# Altium schematic sheet Power.SchDoc
size A3; SheetNumber: 3; SheetTotal: 7
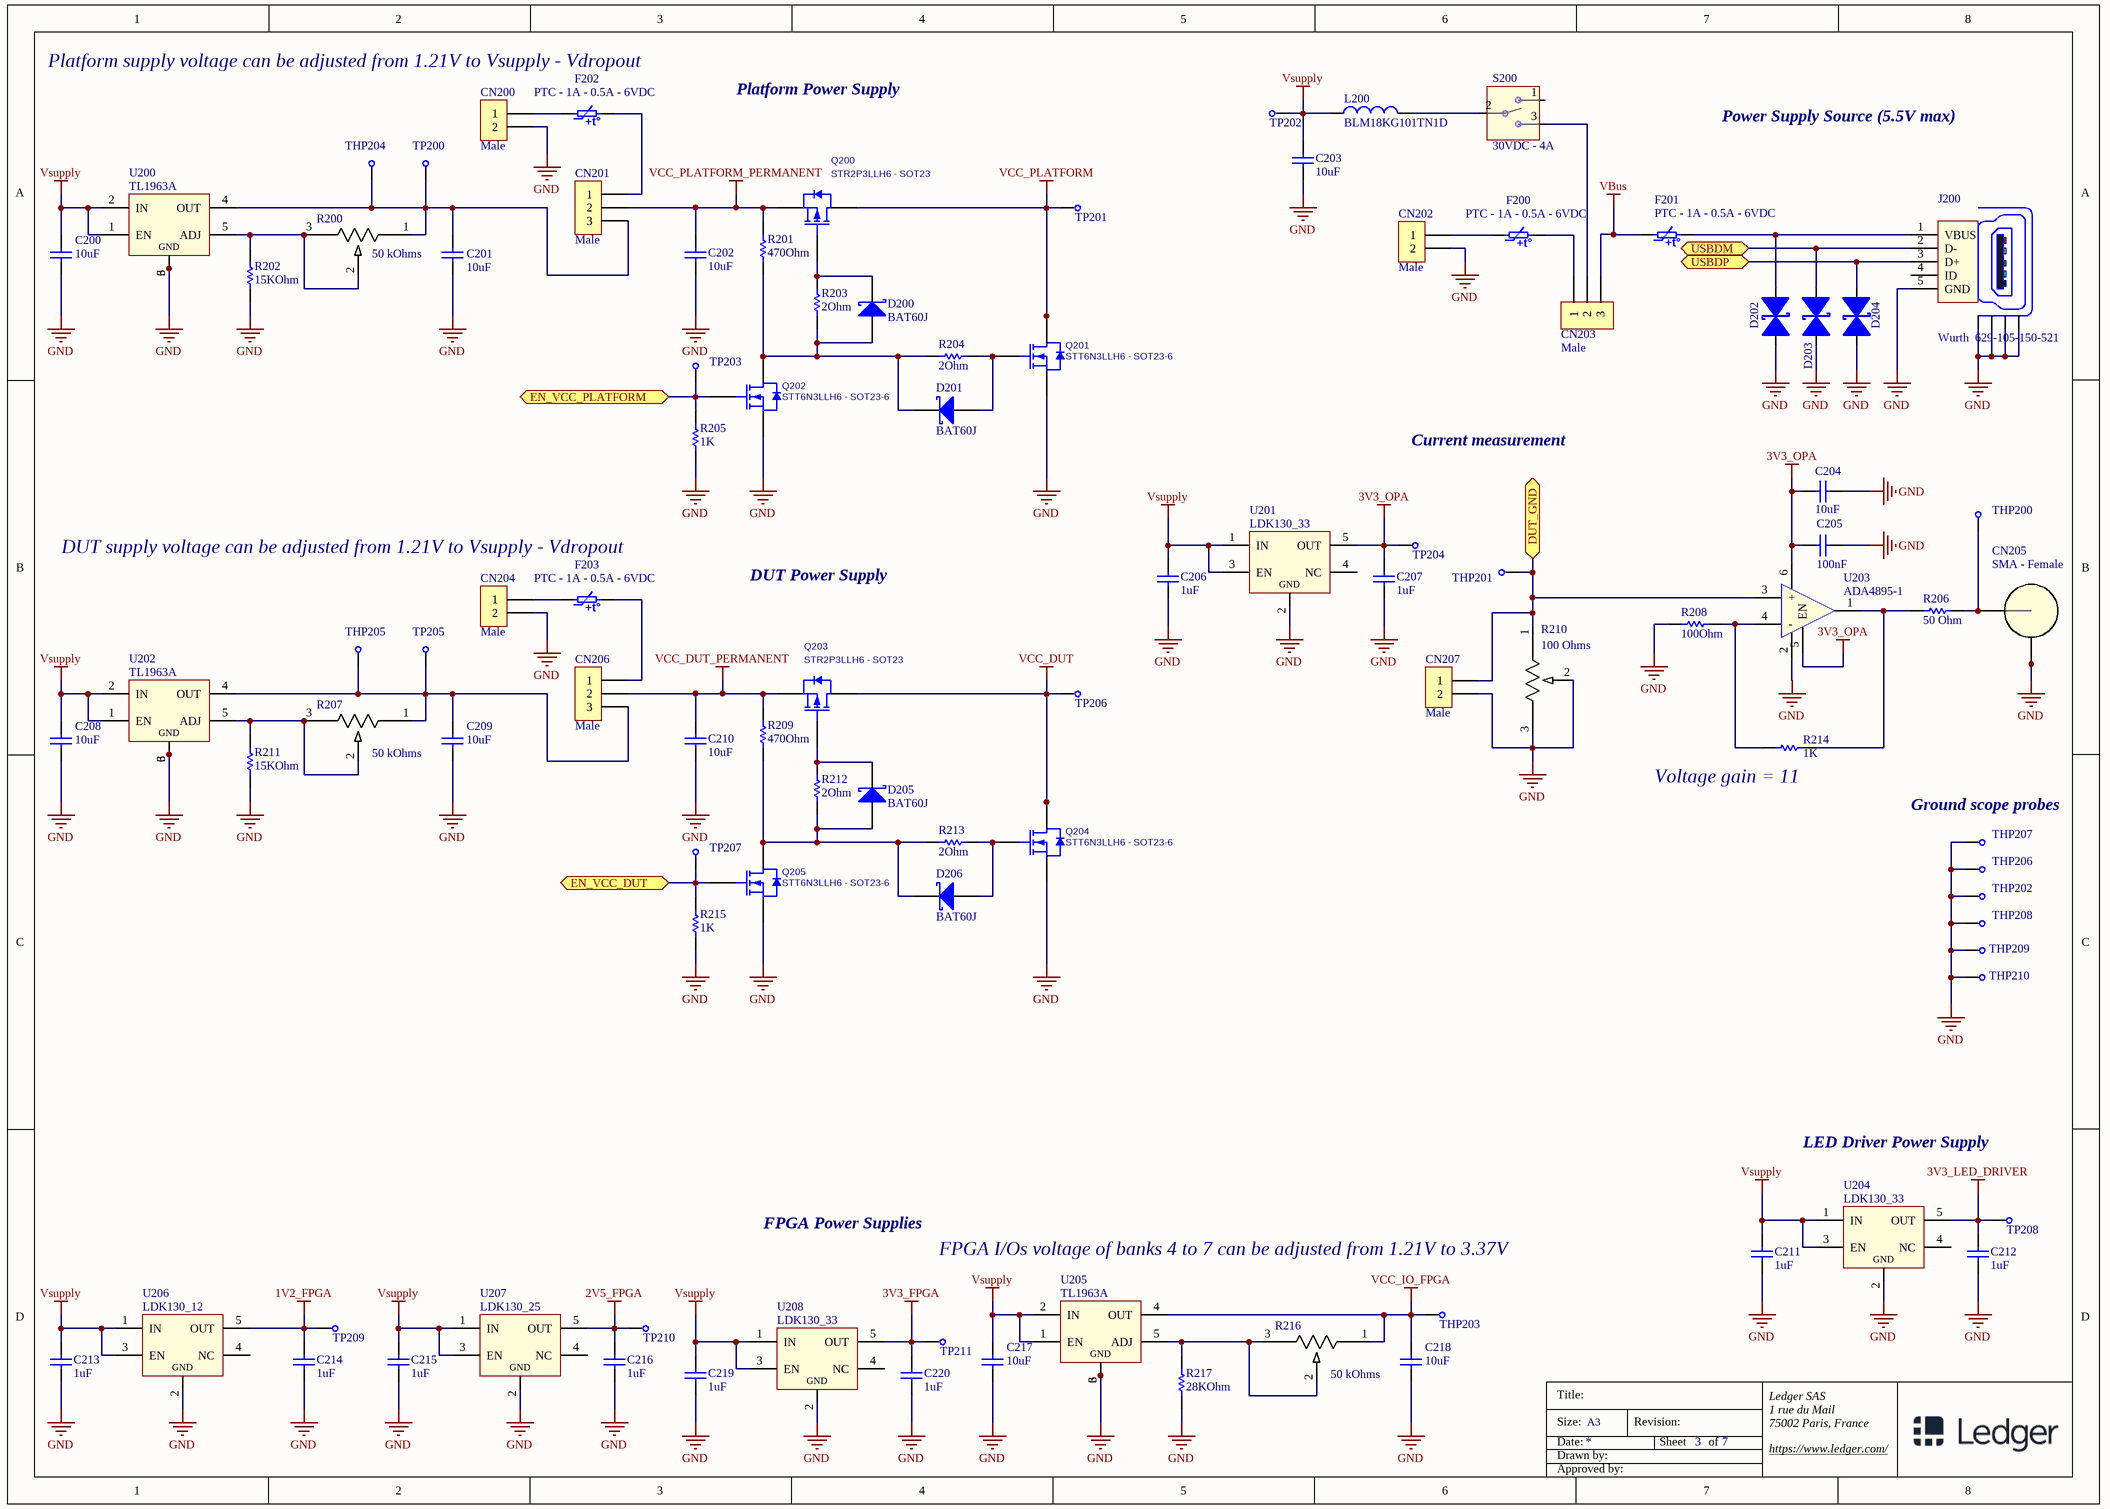
[diagram p0: Power.SchDoc]

## Parts
C200  10uF  [CAP0603]
C201  10uF  [CAP0603]
C202  10uF  [CAP0603]
C203  10uF  [CAP0603]
C204  10uF  [CAP0603]
C205  100nF  [CAP0603]
C206  1uF  [CAP0603]
C207  1uF  [CAP0603]
C208  10uF  [CAP0603]
C209  10uF  [CAP0603]
C210  10uF  [CAP0603]
C211  1uF  [CAP0603]
C212  1uF  [CAP0603]
C213  1uF  [CAP0603]
C214  1uF  [CAP0603]
C215  1uF  [CAP0603]
C216  1uF  [CAP0603]
C217  10uF  [CAP0603]
C218  10uF  [CAP0603]
C219  1uF  [CAP0603]
C220  1uF  [CAP0603]
CN200  Male  [WURTH_691213710002]
CN201  Male  [MOLEX_90120-0123]
CN202  Male  [WURTH_691213710002]
CN203  Male  [MOLEX_90120-0123]
CN204  Male  [WURTH_691213710002]
CN205  SMA - Female  [SAMTEC_SMA-J-P-X-ST-EM3]
CN206  Male  [MOLEX_90120-0123]
CN207  Male  [MOLEX_90120-0122]
D200  BAT60J  [SOD323/A]
D201  BAT60J  [SOD323/A]
D202  ESDAXLC6-1BT2  [SOD882]  (value not drawn)
D203  ESDAXLC6-1BT2  [SOD882]  (value not drawn)
D204  ESDAXLC6-1BT2  [SOD882]  (value not drawn)
D205  BAT60J  [SOD323/A]
D206  BAT60J  [SOD323/A]
F200  PTC - 1A - 0.5A - 6VDC  [FUSE_0805]
F201  PTC - 1A - 0.5A - 6VDC  [FUSE_0805]
F202  PTC - 1A - 0.5A - 6VDC  [FUSE_0805]
F203  PTC - 1A - 0.5A - 6VDC  [FUSE_0805]
J200  Wurth  629-105-150-521  [629105150521]
L200  BLM18KG101TN1D  [0603]
Logo200  Misc - Logo Increase clockwise  [LOGO_CLOCKWISE_INCREASE]  (value not drawn)  (no BOM)
Logo201  Misc - Logo Increase clockwise  [LOGO_CLOCKWISE_INCREASE]  (value not drawn)  (no BOM)
Logo202  Misc - Logo Increase clockwise  [LOGO_CLOCKWISE_INCREASE]  (value not drawn)  (no BOM)
Logo203  Misc - Logo Increase clockwise  [LOGO_CLOCKWISE_INCREASE]  (value not drawn)  (no BOM)
Q200  STR2P3LLH6 - SOT23  [SOT23]
Q201  STT6N3LLH6 - SOT23-6  [SOT95P280X145-6N]
Q202  STT6N3LLH6 - SOT23-6  [SOT95P280X145-6N]
Q203  STR2P3LLH6 - SOT23  [SOT23]
Q204  STT6N3LLH6 - SOT23-6  [SOT95P280X145-6N]
Q205  STT6N3LLH6 - SOT23-6  [SOT95P280X145-6N]
R200  50 kOhms  [POT_3296W]
R201  470Ohm  [RES0603]
R202  15KOhm  [RES0603]
R203  2Ohm  [RES0603]
R204  2Ohm  [RES0603]
R205  1K  [RES0603]
R206  50 Ohm  [RES0603]
R207  50 kOhms  [POT_3296W]
R208  100Ohm  [RES0603]
R209  470Ohm  [RES0603]
R210  100 Ohms  [POT_3296W]
R211  15KOhm  [RES0603]
R212  2Ohm  [RES0603]
R213  2Ohm  [RES0603]
R214  1K  [RES0603]
R215  1K  [RES0603]
R216  50 kOhms  [POT_3296W]
R217  28KOhm  [RES0603]
S200  30VDC - 4A  [SWITCH_25136NAH]
THP200  Misc - Test pin - Through hole - Millmax - 6821-0-00-15-00-00-08-0  [MILLMAX_6821-0-00-15-00-00-08-0]  (value not drawn)
THP201  Misc - Test pin - Through hole - Millmax - 6821-0-00-15-00-00-08-0  [MILLMAX_6821-0-00-15-00-00-08-0]  (value not drawn)
THP202  Misc - Test pin - Through hole - Millmax - 6821-0-00-15-00-00-08-0  [MILLMAX_6821-0-00-15-00-00-08-0]  (value not drawn)
THP203  Misc - Test pin - Through hole - Millmax - 6821-0-00-15-00-00-08-0  [MILLMAX_6821-0-00-15-00-00-08-0]  (value not drawn)
THP204  Misc - Test pin - Through hole - Millmax - 6821-0-00-15-00-00-08-0  [MILLMAX_6821-0-00-15-00-00-08-0]  (value not drawn)
THP205  Misc - Test pin - Through hole - Millmax - 6821-0-00-15-00-00-08-0  [MILLMAX_6821-0-00-15-00-00-08-0]  (value not drawn)
THP206  Misc - Test pin - Through hole - Millmax - 6821-0-00-15-00-00-08-0  [MILLMAX_6821-0-00-15-00-00-08-0]  (value not drawn)
THP207  Misc - Test pin - Through hole - Millmax - 6821-0-00-15-00-00-08-0  [MILLMAX_6821-0-00-15-00-00-08-0]  (value not drawn)
THP208  Misc - Test pin - Through hole - Millmax - 6821-0-00-15-00-00-08-0  [MILLMAX_6821-0-00-15-00-00-08-0]  (value not drawn)
THP209  Misc - Test pin - Through hole - Millmax - 6821-0-00-15-00-00-08-0  [MILLMAX_6821-0-00-15-00-00-08-0]  (value not drawn)
THP210  Misc - Test pin - Through hole - Millmax - 6821-0-00-15-00-00-08-0  [MILLMAX_6821-0-00-15-00-00-08-0]  (value not drawn)
TP200  (no value)  [TP_001]  (no BOM)
TP201  (no value)  [TP_001]  (no BOM)
TP202  (no value)  [TP_001]  (no BOM)
TP203  (no value)  [TP_001]  (no BOM)
TP204  (no value)  [TP_001]  (no BOM)
TP205  (no value)  [TP_001]  (no BOM)
TP206  (no value)  [TP_001]  (no BOM)
TP207  (no value)  [TP_001]  (no BOM)
TP208  (no value)  [TP_001]  (no BOM)
TP209  (no value)  [TP_001]  (no BOM)
TP210  (no value)  [TP_001]  (no BOM)
TP211  (no value)  [TP_001]  (no BOM)
U200  TL1963A  [SOT223-6]
U201  LDK130_33  [SOT95P280X145-5L30]
U202  TL1963A  [SOT223-6]
U203  ADA4895-1  [SOT95P280X145-6N]
U204  LDK130_33  [SOT95P280X145-5L30]
U205  TL1963A  [SOT223-6]
U206  LDK130_12  [SOT95P280X145-5L30]
U207  LDK130_25  [SOT95P280X145-5L30]
U208  LDK130_33  [SOT95P280X145-5L30]

## Ports
DUT_GND, EN_VCC_DUT, EN_VCC_PLATFORM, USBDM, USBDP

## Nets
1V2_FPGA: C214.2 TP209.1 U206.5(OUT)
2V5_FPGA: C216.2 TP210.1 U207.5(OUT)
3V3_FPGA: C220.2 TP211.1 U208.5(OUT)
3V3_LED_DRIVER: C212.2 TP208.1 U204.5(OUT)
3V3_OPA: C204.1 C205.1 C207.2 TP204.1 U201.5(OUT) U203.5(EN) U203.6(VS+)
GND: C200.1 C201.1 C202.1 C203.1 C204.2 C205.2 C206.1 C207.1 C208.1 C209.1 C210.1 C211.1 C212.1 C213.1 C214.1 C215.1 C216.1 C217.1 C218.1 C219.1 C220.1 CN200.2 CN202.2 CN204.2 CN205.2 CN205.3 CN207.2 D202.A D203.A D204.A J200.5(GND) J200.Z1(Shield) J200.Z2(Shield) J200.Z3(Shield) J200.Z4(Shield) Q201.4(S) Q202.4(S) Q204.4(S) Q205.4(S) R202.1 R205.1 R208.1 R210.2 R210.3 R211.1 R215.1 R217.1 THP202.1 THP206.1 THP207.1 THP208.1 THP209.1 THP210.1 U200.3(GND) U200.6(GND) U201.2(GND) U202.3(GND) U202.6(GND) U203.2(GND) U204.2(GND) U205.3(GND) U205.6(GND) U206.2(GND) U207.2(GND) U208.2(GND)
VBus: CN203.3 F201.1
VCC_DUT: Q203.3(D) Q204.1(D) Q204.2(D) Q204.5(D) Q204.6(D) TP206.1
VCC_DUT_PERMANENT: C210.2 CN206.2 Q203.2(S) R209.2
VCC_IO_FPGA: C218.2 R216.1 THP203.1 U205.4(OUT)
VCC_PLATFORM: Q200.3(D) Q201.1(D) Q201.2(D) Q201.5(D) Q201.6(D) TP201.1
VCC_PLATFORM_PERMANENT: C202.2 CN201.2 Q200.2(S) R201.2
Vsupply: C200.2 C203.2 C206.2 C208.2 C211.2 C213.2 C215.2 C217.2 C219.2 L200.1 TP202.1 U200.1(EN) U200.2(IN) U201.1(IN) U201.3(EN) U202.1(EN) U202.2(IN) U204.1(IN) U204.3(EN) U205.1(EN) U205.2(IN) U206.1(IN) U206.3(EN) U207.1(IN) U207.3(EN) U208.1(IN) U208.3(EN)
DUT_GND: CN207.1 R210.1 THP201.1 U203.3(+) ; port DUT_GND
EN_VCC_DUT: Q205.3(G) R215.2 TP207.1 ; port EN_VCC_DUT
EN_VCC_PLATFORM: Q202.3(G) R205.2 TP203.1 ; port EN_VCC_PLATFORM
USBDM: D203.C(K) J200.2(D-) ; port USBDM
USBDP: D204.C(K) J200.3(D+) ; port USBDP
NetC201_2: C201.2 CN201.3 R200.1 THP204.1 TP200.1 U200.4(OUT)
NetC209_2: C209.2 CN206.3 R207.1 THP205.1 TP205.1 U202.4(OUT)
NetCN200_1: CN200.1 F202.1
NetCN201_1: CN201.1 F202.2
NetCN202_1: CN202.1 F200.1
NetCN203_1: CN203.1 F200.2
NetCN203_2: CN203.2 S200.3
NetCN204_1: CN204.1 F203.1
NetCN205_1: CN205.1 R206.2 THP200.1
NetCN206_1: CN206.1 F203.2
NetD200_1: D200.1(A) D201.2(K) Q202.1(D) Q202.2(D) Q202.5(D) Q202.6(D) R201.1 R203.1 R204.1
NetD200_2: D200.2(K) Q200.1(G) R203.2
NetD201_1: D201.1(A) Q201.3(G) R204.2
NetD202_C: D202.C(K) F201.2 J200.1(VBUS)
NetD205_1: D205.1(A) D206.2(K) Q205.1(D) Q205.2(D) Q205.5(D) Q205.6(D) R209.1 R212.1 R213.1
NetD205_2: D205.2(K) Q203.1(G) R212.2
NetD206_1: D206.1(A) Q204.3(G) R213.2
NetL200_2: L200.2 S200.2
NetR200_2: R200.2 R200.3 R202.2 U200.5(ADJ)
NetR206_1: R206.1 R214.2 U203.1(Out)
NetR207_2: R207.2 R207.3 R211.2 U202.5(ADJ)
NetR208_2: R208.2 R214.1 U203.4(-)
NetR216_2: R216.2 R216.3 R217.2 U205.5(ADJ)

Not connected (* = marked no-connect by the designer): J200 4(ID); S200 1; U201 4(NC); U204 4(NC); U206 4(NC); U207 4(NC); U208 4(NC)

## Notes on the sheet
- Platform supply voltage can be adjusted from 1.21V to Vsupply - Vdropout
- Platform Power Supply
- Power Supply Source (5.5V max)
- Current measurement
- DUT supply voltage can be adjusted from 1.21V to Vsupply - Vdropout
- DUT Power Supply
- (near R214) Voltage gain = 11
- (near THP207) Ground scope probes
- LED Driver Power Supply
- FPGA Power Supplies
- FPGA I/Os voltage of banks 4 to 7 can be adjusted from 1.21V to 3.37V
- Title:
- Size:
- Date:
- Drawn by:
- A3
- Revision:
- Sheet
- of
- Ledger SAS
- 1 rue du Mail
- 75002 Paris, France
- https://www.ledger.com/
- Approved by:
- (in symbol Fuse 0805 - PTC Resettable - 1A - 0.5A - 6VDC - 0.9Ohms) +t°

## Library data of the parts
C200-C204 C208-C210 C217 C218 = Capacitor 0603 - 10uF - 16V - X5R - 20%: Manufacturer: Murata; Manufacturer PN: GRM188R61C106MA73D; Manufacturer1: TDK; Manufacturer1 PN: C1608X5R1C106M080AB; Manufacturer2 PN: EMK107BBJ106MA-T; PkgCode: 0603; value: 10uF; Type: X5R; Power: 16V; Tolerance: 20%; Manufacturer2: Taiyo Yuden
C205 = Capacitor 0603 - 100nF - 16V - X7R - 10%: Manufacturer1: Yageo; Manufacturer1 PN: CC0603KRX7R7BB104; Manufacturer2 PN: MCCA000159; Manufacturer: Wurth; Manufacturer PN: 885012206046; PkgCode: 0603; Value: 100nF; Power: 16V; Type: X7R; Tolerance: 10%; Manufacturer2: Multicomp
C206 C207 C211-C216 C219 C220 = Capacitor 0603 -     1uF - 16V - X7R - 10%: Capacitor 0603 - 1uF - 16V - X7R - 10%; Manufacturer: Kemet; Manufacturer PN: C0603C105K4RACTU; Manufacturer1: Murata; Manufacturer1 PN: GCM188R71C105K; Manufacturer2 PN: 885012206052; PkgCode: 0603; Value: 1uF; Type: X7R; Power: 16V; Tolerance: 10%; Manufacturer2: Wurth
CN200 CN202 CN204 = Connector - Wire to Board Terminal Block - 2-Positions - Wurth - 691213710002: NoPins: 2; NoRows: 1; Pitch: 5; Manufacturer: Wurth; Manufacturer PN: 691213710002; Type: Wire to Board
CN201 CN203 CN206 = Connector - Header - 3-Pin - single row - Male - Molex_90120-0123: Manufacturer: Molex; NoPins: 3; NoRows: 1; Pitch: 2.54; Manufacturer PN: 90120-0123; Type: Male
CN205 = Connector - SMA - Female - Horizontal - Mid Mount - Samtec - SMA–J–P–H–ST–EM3: pin to pad: 1>S1 2>G1 3>G2; Impedance: 50 Ohms; Manufacturer: Samtec; Manufacturer PN: SMA–J–P–H–ST–EM3; Type: SMA; Gender: Female
CN207 = Connector - Header - 2-Pin - single row - Male - Molex: Manufacturer PN: 90120-0122; NoPins: 2; NoRows: 1; Pitch: 2.54; Manufacturer: Molex; Type: Male
D200 D201 D205 D206 = Diode -Schottky -10V - 3 A - SOD−323 - BAT60J: Manufacturer: STMicroelectronics; Power: 310mW; PgkCode: SOD-323; Manufacturer PN: BAT60J
D202-D204 = Diode - ESD -15kV -10GHz - ESDAXLC6-1BT2: Manufacturer: STMicroelectronics; Air discharge: 15kV; Body discharge: 8kV; Manufacturer PN: ESDAXLC6-1BT2; PgkCode: SOD882
F200-F203 = Fuse 0805 - PTC Resettable - 1A - 0.5A - 6VDC - 0.9Ohms: Manufacturer: Bel Fuse; Manufacturer PN: 0ZCK0050FF2E; Manufacturer1: Bourns; Manufacturer1 PN: MF-PSMF050X-2; Manufacturer2 PN: 0805L050WR; Max resistance: 900mOhms; Voltage: 6V; PkgCode: 0805; Trip current: 1A; Hold current: 0.5A; Manufacturer2: Littelfuse
J200 = Connector - USB - Micro B - Wurth: NoPins: 5; Manufacturer: Wurth; Manufacturer PN: 629-105-150-521; Type: Micro B
L200 = Ferrite - Bead - 0603 BLM18: Manufacturer: MURATA; Impedance: 100Ohms; Rated Current: 1 A; DC Resistance: 30 mOhms; Manufacturer PN: BLM18KG101TN1D; Pkgref: 0603
Q200 Q203 = Switch - PMOS 30V - STR2P3LLH6 - SOT23: Manufacturer: STMicroelectronics; Manufacturer1: ON Semiconductor; Manufacturer1 PN: CPH3355-TL-W; Manufacturer2 PN: SI2307-TP; ID max (continuous): 2A; VGSmax: 20V; PkgRef: SOT23; Manufacturer PN: STR2P3LLH6; VDSmax: 30V; Manufacturer2: MCC
Q201 Q202 Q204 Q205 = Switch - NMOS 30V - STT6N3LLH6 - SOT23-6: Manufacturer: STMicroelectronics; ID max (continuous): 6A; VGSmax: 20V; PkgRef: SOT23-6; Manufacturer PN: STT6N3LLH6; VDSmax: 30V
R200 R207 R216 = Potentiometer - 50 kOhms - 10% - 0.5W - Bourns - 3296W-1-503RLF: Manufacturer: Bourns Electronics; Turn: 25; Manufacturer PN: 3296W-1-503RLF; Value: 50 kOhms; Power: 0.5W; Tolerance: 10%
R201 R209 = Resistor 0603 -    470Ohm - 1/10W - 1%: Manufacturer: Yageo; Manufacturer PN: RC0603FR-07470RP; Manufacturer1: Panasonic; Manufacturer1 PN: ERJ3EKF4700; Manufacturer2 PN: RK73H1JTTD4700F; PkgCode: 0603; Value: 470Ohm; Tolerance: 1%; Power: 1/10W; Manufacturer2: KOA Speer
R202 R211 = Resistor 0603 -    15KOhm - 1/10W - 1%: Manufacturer: Yageo; Manufacturer PN: RC0603FR-1015KL; Manufacturer1: Panasonic; Manufacturer1 PN: ERJ3EKF1502; Manufacturer2 PN: RK73H1JHT..1502F; PkgCode: 0603; Value: 15KOhm; Tolerance: 1%; Power: 1/10W; Manufacturer2: KOA Speer
R203 R204 R212 R213 = Resistor 0603 -      2Ohm - 1/10W - 1%: Resistor 0603 - 2Ohm - 1/10W - 1%; Manufacturer: Vishay; Manufacturer PN: CRCW06032R00FKEA; PkgCode: 0603; Value: 2Ohm; Tolerance: 1%; Power: 1/10W
R205 R214 R215 = Resistor 0603 -      1KOhm - 1/10W - 1%: Resistor 0603 - 1KOhm - 1/10W - 1%; Manufacturer: Yageo; Manufacturer PN: RC0603FR-071KL; PkgCode: 0603; Value: 1K; Tolerance: 1%; Power: 1/10W
R206 = Resistor 0603 -  50Ohm - 1/10W - 1%: Manufacturer PN: CRCW060350R0FKEA; Manufacturer: Vishay; PkgCode: 0603; Value: 50 Ohm; Power: 1/10W; Tolerance: 1%
R208 = Resistor 0603 -    100Ohm - 1/10W - 1%: Manufacturer: Vishay; Manufacturer PN: CRCW0603100RFKEA; PkgCode: 0603; Value: 100Ohm; Tolerance: 1%; Power: 1/10W
R210 = Potentiometer - 100 Ohms - 25 turns - 10% - 0.5W - Bourns - 3296W-1-101LF: Manufacturer: Bourns Electronics; turns: 25; Manufacturer PN: 3296W-1-101LF; Value: 100 Ohms; Power: 0.5W; Tolerance: 10%
R217 = Resistor 0603 -    28KOhm - 1/10W - 1%: Manufacturer: Yageo; Manufacturer PN: AC0603FR-0728KL; Manufacturer1: Panasonic; Manufacturer1 PN: ERJ3EKF2802; Manufacturer2 PN: RK73H1JHT..2802F; PkgCode: 0603; Value: 28KOhm; Tolerance: 1%; Power: 1/10W; Manufacturer2: KOA Speer
S200 = Slide switch - 4A - 30VDC - APEM - 25136NAH: Manufacturer: APEM; Manufacturer PN: 25136NAH; Current: 4A
THP200-THP210 = Misc - Test pin - Through hole - Millmax - 6821-0-00-15-00-00-08-0: Manufacturer: Mill-max; Manufacturer PN: 6821-0-00-15-00-00-08-0
TP200-TP211 = Misc - Test point CMS
U200 U202 U205 = Power - LDO - Adj - 20V - 1.5A - SOT223-6: Manufacturer PN: TL1963ADCQR; Manufacturer: Texas Instruments; Tolerance: 70mV; PkgCode: SOT223-6; Value: ADJ; Power: 1.5A
U201 U204 U208 = Power - LDO - 3.3V - 300 mA - SOT23-5L: Manufacturer PN: LDK130M33R; Manufacturer: STMicroelectronics; Power: 300mA; Tolerance: 3%; PkgCode: SOT23-5L; Value: 3.3V
U203 = Power - Operationnal amplifier - ADA4895-1: Manufacturer: Analog Device; Manufacturer PN: ADA4895-1ARJZ-R; Gain: 95 dB; PkgCode: SOT23-6L
U206 = Power - LDO - 1.2V - 300 mA - SOT23-5L: Manufacturer PN: LDK130M12R; Manufacturer: STMicroelectronics; Power: 300mA; Tolerance: 3%; PkgCode: SOT23-5L; Value: 1.2V
U207 = Power - LDO - 2.5V - 300 mA - SOT23-5L: Manufacturer PN: LDK130M25R; Manufacturer: STMicroelectronics; Power: 300mA; Tolerance: 3%; PkgCode: SOT23-5L; Value: 2.5V